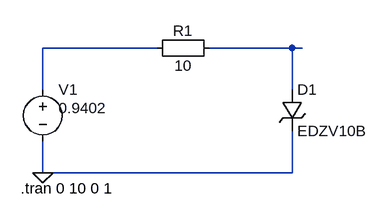
[diagram p0: schematic Versuch1 Schaltung 4.asc]
Versuch1 Schaltung 4.asc, the LTspice schematic file:
Version 4
SHEET 1 880 680
WIRE 208 64 32 64
WIRE 416 64 288 64
WIRE 432 64 416 64
WIRE 32 128 32 64
WIRE 416 128 416 64
WIRE 32 256 32 208
WIRE 416 256 416 192
WIRE 416 256 32 256
FLAG 32 256 0
SYMBOL zener 400 128 R0
SYMATTR InstName D1
SYMATTR Value EDZV10B
SYMATTR Description Diode
SYMATTR Type diode
SYMBOL voltage 32 112 R0
WINDOW 3 24 44 Left 2
WINDOW 123 0 0 Left 0
WINDOW 39 0 0 Left 0
SYMATTR InstName V1
SYMATTR Value 0.9402
SYMBOL Misc\\EuropeanResistor 304 48 R90
WINDOW 0 5 56 VBottom 2
WINDOW 3 27 56 VTop 2
SYMATTR InstName R1
SYMATTR Value 10
TEXT -2 280 Left 2 !.tran 0 10 0 1

The netlist it stands for:
* Versuch1 Schaltung 4.asc
D1 N002 0 EDZV10B
V1 N001 0 0.9402
R1 N002 N001 10
.model D D
.lib standard.dio
.tran 0 10 0 1
.backanno
.end